# EAGLE schematic Alice (EAGLE 7.4.0)
Alice <http://www.scotthelmke.com/alice-mic.html> Schematics - simple Schoeps <http://www.sdiy.org/oid/mics/Schoeps.gif> derivative.
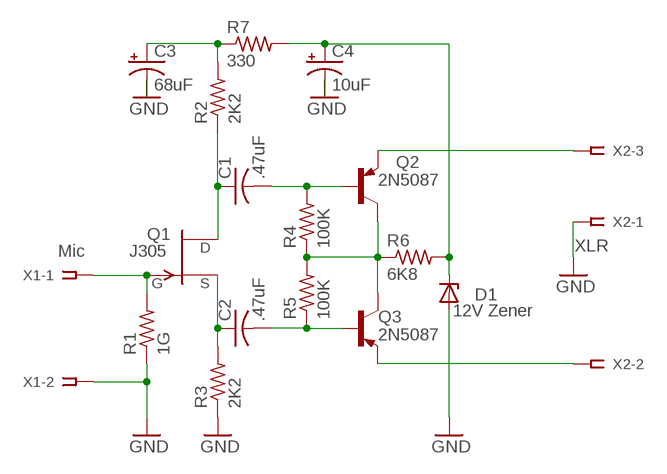
[diagram p0: schematic, sheet 1]

## Parts
C1  .47uF  C-US075-052X106  [C075-052X106]
C2  .47uF  C-US075-052X106  [C075-052X106]
C3  68uF  CPOL-USE3.5-10  [E3,5-10]
C4  10uF  CPOL-USE1.8-4  [E1,8-4]
D1  12V Zener  ZENER-DIODEDO35Z10  [DO35Z10]
Q1  J305  2N5950  [TO-92]
Q2  2N5087  2N2907  [TO92-EBC-OVAL]
Q3  2N5087  2N2907  [TO92-EBC-OVAL]
R1  1G  R-US_0204/7  [0204/7]
R2  2K2  R-US_0204/7  [0204/7]
R3  2K2  R-US_0204/7  [0204/7]
R4  100K  R-US_0204/7  [0204/7]
R5  100K  R-US_0204/7  [0204/7]
R6  6K8  R-US_0204/7  [0204/7]
R7  330  R-US_0204/7  [0204/7]
X1  Mic  SSW-101-02-S-D  [SSW-101-02-S-D]
X2  XLR  SSW-101-02-S-T  [SSW-101-02-S-T]

## Nets
N$1: C1.1 Q1.3(D) R2.1
N$2: Q2.E X2.3
N$3: C3.+ R2.2 R7.1
N$4: C2.1 Q1.2(S) R3.2
N$5: Q2.C Q3.C R4.1 R5.2 R6.1
N$6: C1.2 Q2.B R4.2
N$7: C2.2 Q3.B R5.1
N$8: Q1.1(G) R1.2 X1.1
N$9: C4.+ D1.C R6.2 R7.2
N$10: Q3.E X2.2
XLR-1: C3.- C4.- D1.A R1.1 R3.1 X1.2 X2.1 ; supply symbol labelled GND

## Library data of the parts
C1 C2 = adafruit:C-US: CAPACITOR, American symbol
C3 C4 = adafruit:CPOL-US: POLARIZED CAPACITOR, American symbol
D1 = diode:ZENER-DIODE: Z-Diode
Q1 = transistor-fet:2N5950: N-Channel JFET RF Amplifier
Q2 Q3 = adafruit:2N2907*: PNP Transistor Big Oval pads
R1-R7 = adafruit:R-US_: RESISTOR, American symbol
X1 = con-samtec:SSW-101-02-S-D: THROUGH-HOLE .025" SQ POST SOCKET Source: Samtec SSW.pdf; MPN: SSW-101-02-S-D; OC_FARNELL: unknown; OC_NEWARK: 82P1456
X2 = con-samtec:SSW-101-02-S-T: THROUGH-HOLE .025" SQ POST SOCKET Source: Samtec SSW.pdf; MPN: SSW-101-02-S-T; OC_FARNELL: unknown; OC_NEWARK: 82P1460

## Net classes
0 default: width 0.61 mm, drill 0.508 mm, clearance 0.254 mm